# Altium schematic sheet POWER-BATTERY.SchDoc
size A4; SPICEModelCacheDLZXOQBQ: <root> / <DocumentId>DLZXOQBQ</DocumentId> / <CacheFrame Number="0"> / <Model Name="skydiode" Kind="MDL"> / <Text>*Default Schottky Diode / *Schottky Diode Pinout: A,K / .MODEL SKYDIODE D(EG=0.69 XTI=2)</Text> / </Model> / </CacheFrame> / </root>; SheetNumber: 3; SheetTotal: 7
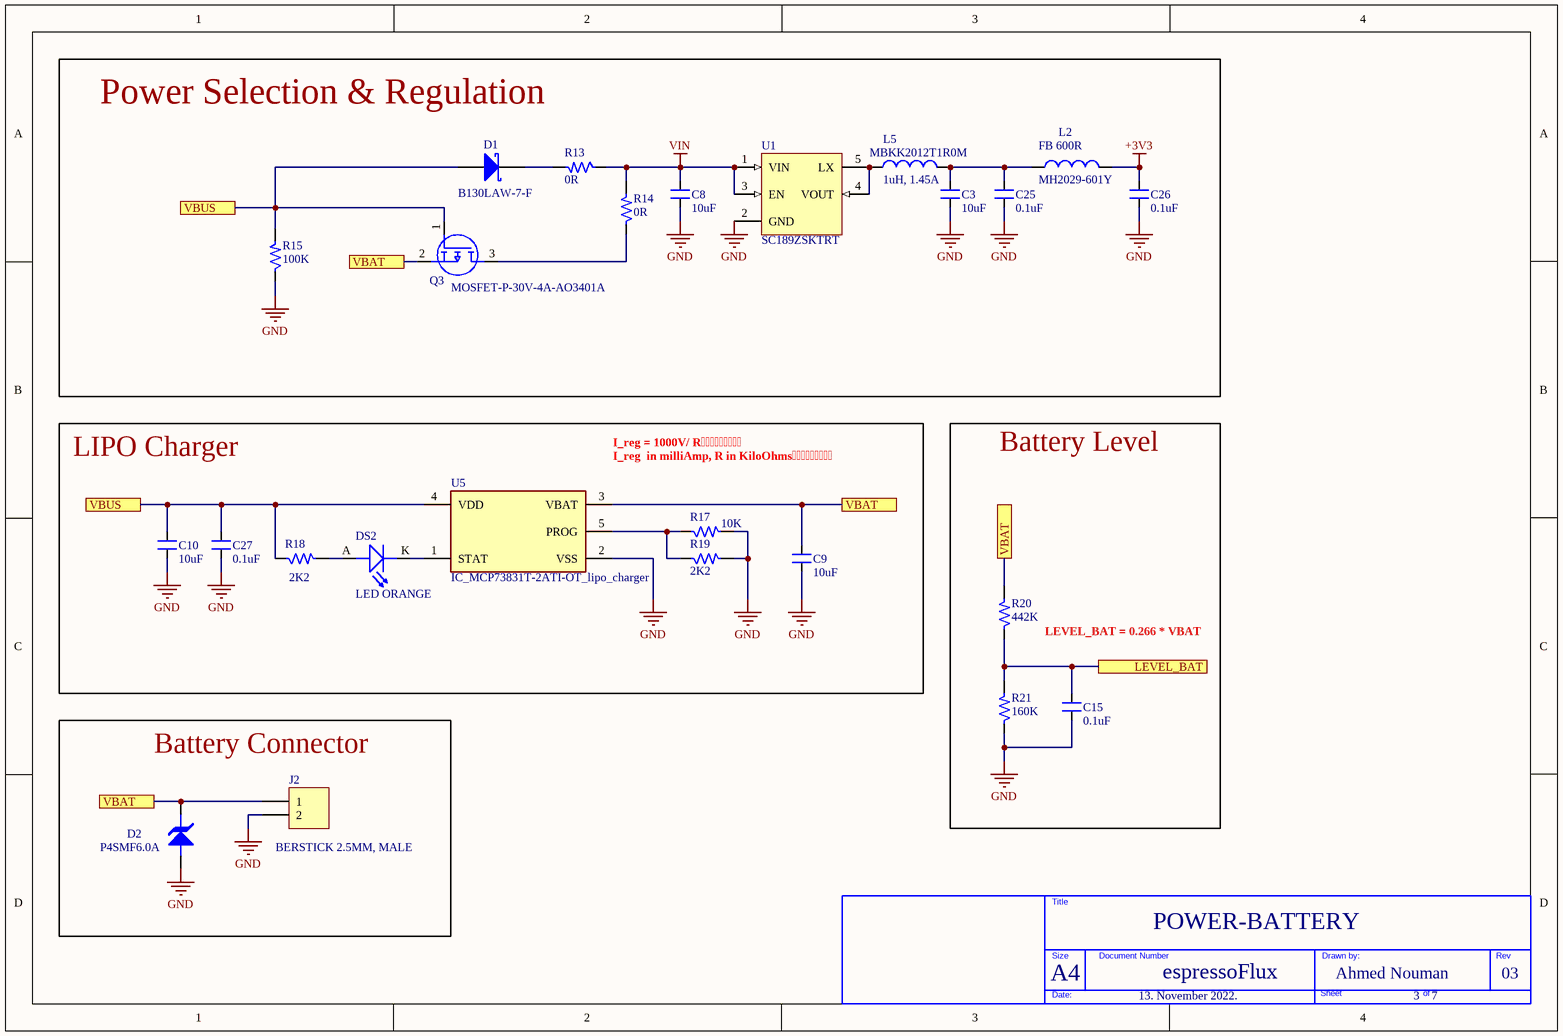
[diagram p0: POWER-BATTERY.SchDoc]

## Parts
?  (no value)  (graphical)
C3  10uF  [CAP_0805]
C8  10uF  [CAP_0805]
C9  10uF  [CAP_0805]
C10  10uF  [CAP_0805]
C15  0.1uF  [CAP_0805]
C25  0.1uF  [CAP_0805]
C26  0.1uF  [CAP_0805]
C27  0.1uF  [CAP_0805]
D1  B130LAW-7-F  [SOD123 - DOT]
D2  P4SMF6.0A  [SOD123FL]
DS2  LED ORANGE  [LED_0805]
J2  BERSTICK 2.5MM, MALE  [CON2_100_43D62_TH_ST]
L2  MH2029-601Y  [INDC2012N]
L5  MBKK2012T1R0M  [INDC2012N]
Q3  MOSFET-P-30V-4A-AO3401A  [P_channelMos_AO3401A]
R13  0R  [RES_0805]
R14  0R  [RES_0805]
R15  100K  [RES_0805]
R17  10K  [RES_0805]
R18  2K2  [RES_0805]
R19  2K2  [RES_0805]
R20  442K  [RES_0805]
R21  160K  [RES_0805]
U1  SC189ZSKTRT  [SOT23-5]
U5  IC_MCP73831T-2ATI-OT_lipo_charger  [SOT23-5]

## Blocks framed on the sheet
Power Selection & Regulation: C3 C8 C25 C26 D1 L2 L5 Q3 R13-R15 U1
LIPO Charger: C9 C10 C27 DS2 R17-R19 U5
Battery Level: C15 R20 R21
Battery Connector: D2 J2

## Ports
LEVEL_BAT, VBAT, VBUS

## Nets
+3V3: C26.2 L2.2
GND: C3.1 C8.1 C9.1 C10.1 C15.1 C25.1 C26.1 C27.1 D2.1 J2.2 R15.1 R17.2 R19.2 R21.1 U1.2(GND) U5.2(VSS)
VIN: C8.2 R13.1 R14.2 U1.1(VIN) U1.3(EN)
LEVEL_BAT: C15.2 R20.1 R21.2 ; port LEVEL_BAT
VBAT: C9.2 D2.2 J2.1 Q3.2(S) R20.2 U5.3(VBAT) ; port VBAT
VBUS: C10.2 C27.2 D1.1(A) Q3.1(G) R15.2 R18.1 U5.4(VDD) ; port VBUS
NetC3_2: C3.2 C25.2 L2.1 L5.2
NetD1_2: D1.2(K) R13.2
NetDS2_A: DS2.A(ANODE) R18.2
NetDS2_K: DS2.K(CATHODE) U5.1(STAT)
NetL5_1: L5.1 U1.4(VOUT) U1.5(LX)
NetQ3_3: Q3.3(D) R14.1
NetR17_1: R17.1 R19.1 U5.5(PROG)

## Notes on the sheet
- (near L2) FB 600R
- 1uH, 1.45A
- I_reg = 1000V/ R
- I_reg  in milliAmp, R in KiloOhms
- LEVEL_BAT = 0.266 * VBAT
- A4
- POWER-BATTERY
- espressoFlux
- Ahmed Nouman
- 03
- 13. November 2022.
- 3    7
- Title
- Size
- Document Number
- Drawn by:
- Rev
- Date:
- Sheet
- of

## Library data of the parts
? = TITLE BLOCK_BLANK
C3 C8 = CAP_1uF-50V-10%-0805_1: 1µF ±10% 50V Ceramic Capacitor X7R 0805 (2012 Metric); Manufacturer: Samsung; Manufacturer Part Number: CL21B104KBCNNNC; Alternate Part Number-1: NA; Case/Package: 0805; Supplier-1: SIRICOM; Supplier Part Number-1: 0805B104K500CT
C9 C10 = CAP_10uF-50V-10%-0805_1: 10µF ±10% 50V Ceramic Capacitor X7R 0805 (2012 Metric); Manufacturer: Samsung; Manufacturer Part Number: CL21B104KBCNNNC; Alternate Part Number-1: NA; Case/Package: 0805; Supplier-1: SIRICOM; Supplier Part Number-1: 0805B104K500CT
C15 C25-C27 = CAP_0.1uF-50V-20%-0805: 0.1µF ±20% 50V Ceramic Capacitor X7R 0805 (2012 Metric); Manufacturer: Samsung Electro-Mechanics; Manufacturer Part Number: CL21B104MBCNNNC; Alternate Part Number-1: NA; Case/Package: 0805; Supplier-1: SIRICOM; Supplier Part Number-1: 0805B104K500CT
D1 = D Schottky: Schottky Diode; Published: 8-Jun-2000; LatestRevisionDate: 17-Jul-2002; LatestRevisionNote: Re-released for DXP Platform.; PackageReference: SMB; Publisher: Altium Limited; PackageDescription: DO-214-AA/SMB; 2 C-Bend Leads; Body 5.3 x 3.6 mm, inc. leads (LxW); Code_JEDEC: DO-214-AA
D2 = TVS-UNIDIRECTIONAL: Value: *
DS2 = LED_ORANGE-2V-20mA-0805: Orange 605nm LED Indication - Discrete 2V 0805 (2012 Metric); Manufacturer: Vishay Lite-On; Manufacturer Part Number: LTST-C170KFKT; Alternate Part Number-1: NA; Case/Package: 0805; Supplier-1: SP ROAD; Supplier Part Number-1: LTST-C170KFKT
J2 = CON-BS-PLG_2X1-100-ST-TH: 2 Pins, 1 Row 2.54mm Pitch, Straight bergstrip, Male; Manufacturer Part Number: NA; Manufacturer: Samtec; Case/Package: TH-CON; Supplier-1: SP ROAD; Supplier Part Number-1: NA; Alternate Part Number-1: NA
L2 = Inductor: Code_IEC: 1005; Value: MPZ1608S601A; Published: 8-Jun-2000; LatestRevisionDate: 17-Jul-2002; LatestRevisionNote: Re-released for DXP Platform.; PackageReference: 0402-A; Publisher: Altium Limited; Code_JEITA: 0402
L5 = Inductor: 1 µH Shielded Drum Core, Wirewound Inductor 1.45 A 106mOhm Max 0805 (2012 Metric); Code_IEC: 1005; Value: MPZ1608S601A; Published: 8-Jun-2000; LatestRevisionDate: 17-Jul-2002; LatestRevisionNote: Re-released for DXP Platform.; PackageReference: 0402-A; Publisher: Altium Limited; Code_JEITA: 0402
Q3 = MOSFET-P-30V-4A-AO3401A: 30V P-Channel MOSFET 4A Rdson = 85 mOhms
R13 R14 = RES_0R-0.125W-1%-0805: 0 Ohms Jumper 0.125W, 1/8W Chip Resistor 0805 (2012 Metric) Automotive AEC-Q200 Thick Film; Manufacturer: Walsin; Manufacturer Part Number: WR08X000PTL; Case/Package: 0805; Supplier-1: SIRICOM; Supplier Part Number-1: WR08X000PTL; Alternate Part Number-1: WR08X000PTL
R15 = RES_100K-0.125W-1%-0805: 100 kOhms ±1% 0.125W, 1/8W Chip Resistor 0805 (2012 Metric) Automotive AEC-Q200 Thick Film; Manufacturer: Walsin; Manufacturer Part Number: WR08X1003FTL; Alternate Part Number-1: NA; Case/Package: 0805; Supplier-1: SIRICOM; Supplier Part Number-1: WR08X1003FTL
R17 = RES_10K-0.125W-1%-0805: 10 kOhms ±1% 0.125W, 1/8W Chip Resistor 0805 (2012 Metric) Automotive AEC-Q200 Thick Film; Manufacturer: CTS; Manufacturer Part Number: WR08X1002FTL; Case/Package: 0805; Supplier-1: SIRICOM; Supplier Part Number-1: WR08X1002FTL; Alternate Part Number-1: WR08X1002FTL
R18 R19 = RES_2.2K-0.125W-1%-0805: 2.2 kOhms ±1% 0.125W, 1/8W Chip Resistor 0805 (2012 Metric) Thick Film; Manufacturer: Stackpole Electronics; Manufacturer Part Number: CRG0805F2K2; Alternate Part Number-1: CR0805F82201G; Case/Package: 0805; Supplier-1: SIRICOM; Supplier Part Number-1: WR08X2201FTL
R20 = RES_442K-0.125W-1%-0805_1: 442kOhms ±1% 0.125W, 1/8W Chip Resistor 0805 (2012 Metric) Thick Film; Manufacturer: TE Connectivity Passive Product; Manufacturer Part Number: CRG0805F1K5; Alternate Part Number-1: NA; Case/Package: 0805; Supplier-1: SIRICOM; Supplier Part Number-1: NA
R21 = RES_160K-0.125W-1%-0805_1_1: 160kOhms ±1% 0.125W, 1/8W Chip Resistor 0805 (2012 Metric) Thick Film; Manufacturer: TE Connectivity Passive Product; Manufacturer Part Number: CRG0805F1K5; Alternate Part Number-1: NA; Case/Package: 0805; Supplier-1: SIRICOM; Supplier Part Number-1: NA
U1 = SC189ZSKTRT: Buck Switching Regulator IC Positive Fixed 3.3V 1 Output 1.5A SC-74A, SOT-753